# EAGLE schematic clock-digits (EAGLE 7.5.0)
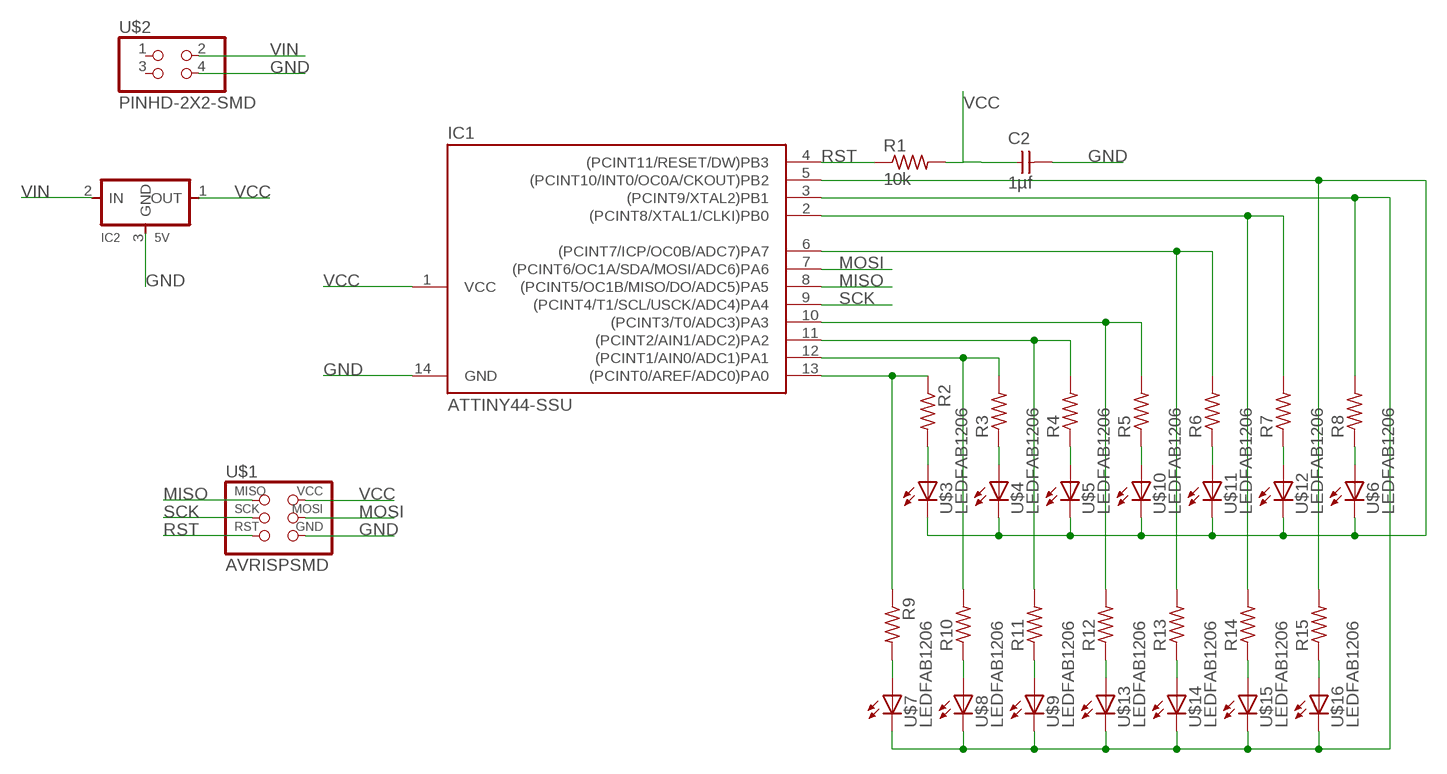
[diagram p0: schematic, sheet 1]

## Parts
C2  1µf  CAP-UNPOLARIZEDFAB  [C1206FAB]
IC1  ATTINY44-SSU  [SOIC14]
IC2  5V  REGULATORSOT23  [SOT23]
R1  10k  RES-US1206FAB  [R1206FAB]
R2  RES-US1206FAB  [R1206FAB]
R3  RES-US1206FAB  [R1206FAB]
R4  RES-US1206FAB  [R1206FAB]
R5  RES-US1206FAB  [R1206FAB]
R6  RES-US1206FAB  [R1206FAB]
R7  RES-US1206FAB  [R1206FAB]
R8  RES-US1206FAB  [R1206FAB]
R9  RES-US1206FAB  [R1206FAB]
R10  RES-US1206FAB  [R1206FAB]
R11  RES-US1206FAB  [R1206FAB]
R12  RES-US1206FAB  [R1206FAB]
R13  RES-US1206FAB  [R1206FAB]
R14  RES-US1206FAB  [R1206FAB]
R15  RES-US1206FAB  [R1206FAB]
U$1  AVRISPSMD  [2X03SMD]
U$2  PINHD-2X2-SMD  [2X02SMD]
U$3  LEDFAB1206  [LED1206FAB]
U$4  LEDFAB1206  [LED1206FAB]
U$5  LEDFAB1206  [LED1206FAB]
U$6  LEDFAB1206  [LED1206FAB]
U$7  LEDFAB1206  [LED1206FAB]
U$8  LEDFAB1206  [LED1206FAB]
U$9  LEDFAB1206  [LED1206FAB]
U$10  LEDFAB1206  [LED1206FAB]
U$11  LEDFAB1206  [LED1206FAB]
U$12  LEDFAB1206  [LED1206FAB]
U$13  LEDFAB1206  [LED1206FAB]
U$14  LEDFAB1206  [LED1206FAB]
U$15  LEDFAB1206  [LED1206FAB]
U$16  LEDFAB1206  [LED1206FAB]

## Nets
GND: C2.2 IC1.14(GND) IC2.3(GND) U$1.6(GND) U$2.4
MISO: IC1.8((PCINT5/OC1B/MISO/DO/ADC5)PA5) U$1.1(MISO)
MOSI: IC1.7((PCINT6/OC1A/SDA/MOSI/ADC6)PA6) U$1.4(MOSI)
N$1: IC1.13((PCINT0/AREF/ADC0)PA0) R2.1 R9.1
N$2: R2.2 U$3.1(A)
N$3: IC1.12((PCINT1/AIN0/ADC1)PA1) R3.2 R10.2
N$4: R3.1 U$4.1(A)
N$5: IC1.11((PCINT2/AIN1/ADC2)PA2) R4.2 R11.2
N$6: R4.1 U$5.1(A)
N$7: IC1.10((PCINT3/T0/ADC3)PA3) R5.2 R12.2
N$8: R5.1 U$10.1(A)
N$9: IC1.6((PCINT7/ICP/OC0B/ADC7)PA7) R6.2 R13.2
N$10: R6.1 U$11.1(A)
N$11: IC1.2((PCINT8/XTAL1/CLKI)PB0) R7.2 R14.2
N$12: R7.1 U$12.1(A)
N$14: R8.1 U$6.1(A)
N$15: IC1.5((PCINT10/INT0/OC0A/CKOUT)PB2) R15.2 U$3.2(C) U$4.2(C) U$5.2(C) U$6.2(C) U$10.2(C) U$11.2(C) U$12.2(C)
N$16: R9.2 U$7.1(A)
N$17: R15.1 U$16.1(A)
N$18: R10.1 U$8.1(A)
N$20: R11.1 U$9.1(A)
N$21: R12.1 U$13.1(A)
N$23: R13.1 U$14.1(A)
N$24: R14.1 U$15.1(A)
N$28: IC1.3((PCINT9/XTAL2)PB1) R8.2 U$7.2(C) U$8.2(C) U$9.2(C) U$13.2(C) U$14.2(C) U$15.2(C) U$16.2(C)
RST: IC1.4((PCINT11/RESET/DW)PB3) R1.1 U$1.5(RST)
SCK: IC1.9((PCINT4/T1/SCL/USCK/ADC4)PA4) U$1.3(SCK)
VCC: IC1.1(VCC) IC2.1(OUT) R1.2 U$1.2(VCC)
VIN: IC2.2(IN) U$2.2
Unconnected: C2.1 U$2.1 U$2.3

## Library data of the parts
C2 = fab:CAP-UNPOLARIZED
IC1 = fab:ATTINY44
IC2 = fab:REGULATOR
R1-R15 = fab:RES-US: Resistor (US Symbol) Variants with postfix FAB are widened to allow the routing of internal traces
U$1 = fab:AVRISP
U$2 = fab:PINHD-2X2-SMD
U$3-U$16 = fab:LED: LED

## Net classes
0 default: width 0.483 mm, clearance 1.626 mm